# Altium project ESP32 with USB-C.PrjPcb (part 3 of 3)
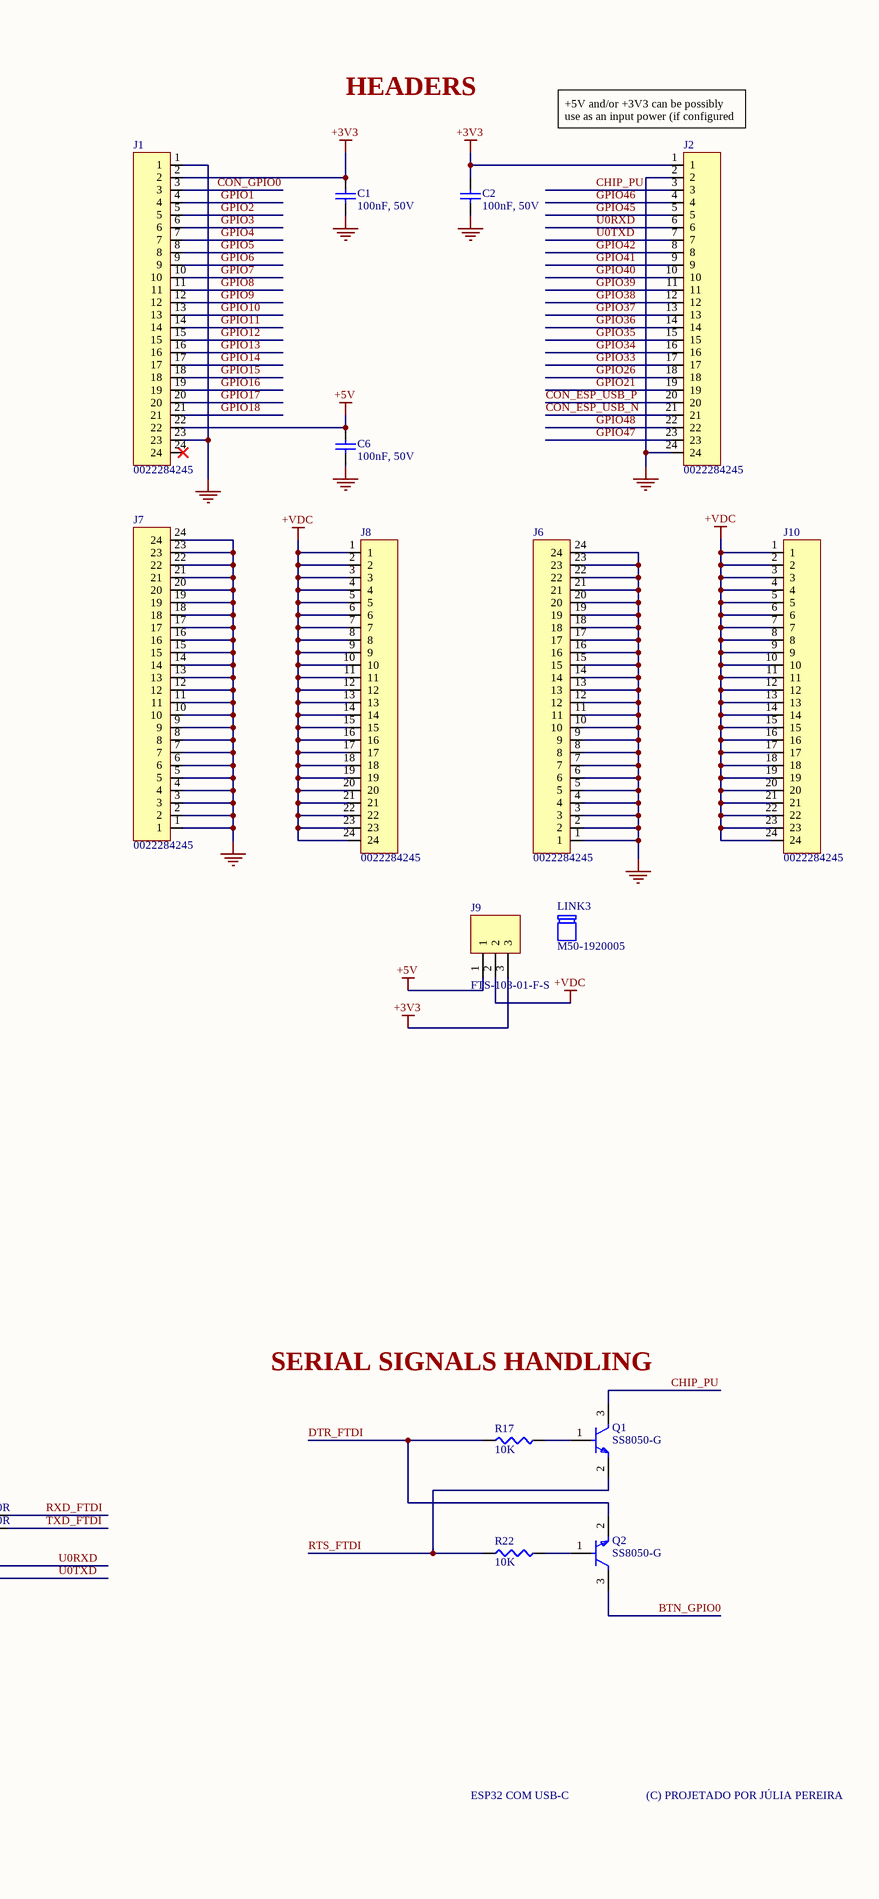
[diagram p3: ESP32 with USBC.SchDoc, right]

## Sheet ESP32 with USBC.SchDoc (continued)

### Library data of the parts (continued)
R13 R16 R17 R22 = AC0402FR-0710KL: 10 kOhms ±1% 0,063W, 1/16W Resistor de chip 0402 (métrico 1005) AEC-Q200 automotivo, resistente a umidade Filme grosso; Manufacturer: Yageo Group; Max Power Dissipation: 63mW; Power Rating: 62.5mW; Value: 10kΩ; Temperature Coefficient: 100ppm/°C; Voltage Rating: 50V; Supplier: DigiKey; Supplier Part Number: YAG3436DKR-ND; Manufacturer Part Number: AC0402FR-0710KL; RoHS: Compliant; Category: Chip SMD Resistors; Stock: 2542190; Pricing: 1=0.1, 10=0.024, 25=0.0176, 50=0.014, 100=0.0114, 250=0.00876, 500=0.00726, 1000=0.00612, 5000=0.00431 (USD); Case/Package: 0402; Case Code (Imperial): 0402; Case Code (Metric): 1005; China RoHS: Non-Compliant; Composition: Thick Film; Country of Origin: Mainland China, Taiwan; Depth: 500µm; Export Control Classification Number (ECCN) Code: EAR99; Features: Automotive AEC-Q200, Moisture Resistant; Height: 320µm; Harmonized Tariff Schedule (HTS) Code: 8533.21.00.30; Introduction Date: 2012-04-10; Lead Free: Lead Free; Length: 1mm; Lifecycle Status: Production; Max Operating Temperature: 155°C; Military Standard: Not; Min Operating Temperature: -55°C; Mounting Technology: Surface Mount; Number of Terminals: 2; Number of Terminations: 2; Packaging: Tape & Reel; Ratings: AEC-Q200; REACH SVHC: Yes; Schedule B: 8533210045, 8533210045|8533210045|8533210045|8533210045|8533210045|8533210045|8533210045|8533210045|8533210045|8533210045|8533210045|8533210045|8533210045|8533210045|8533210045|8533210045|8533210045|8533210045|8533210045, 8533210045|8533210045|8533210045|8533210045|8533210045|8533210045|8533210045|8533210045|8533210045|8533210045|8533210045|8533210045|8533210045|8533210045|8533210045|8533210045|8533210045|8533210045|8533210045|8533210045|8533210045|8533210045|8533210045|85; Termination: SMD/SMT; Tolerance: 1%; Width: 500µm; Working Voltage: 50V; ComponentLink1URL: https://datasheet.octopart.com:443/AC0402FR-0710KL-Yageo-datasheet-182189377.pdf?src-supplier=IHS; ComponentLink1Description: https://datasheet.octopart.com:443/AC0402FR-0710KL-Yageo-datasheet-182189377.pdf?src-supplier=IHS; ComponentLink2URL: https://datasheet.octopart.com:443/AC0402FR-0710KL-Yageo-datasheet-83209224.pdf?src-supplier=Upverter; ComponentLink2Description: https://datasheet.octopart.com:443/AC0402FR-0710KL-Yageo-datasheet-83209224.pdf?src-supplier=Upverter; ComponentLink3URL: https://datasheet.octopart.com:443/AC0402FR-0710KL-Yageo-datasheet-178509465.pdf?src-supplier=Newark; ComponentLink3Description: https://datasheet.octopart.com:443/AC0402FR-0710KL-Yageo-datasheet-178509465.pdf?src-supplier=Newark; ComponentLink4URL: https://datasheet.octopart.com:443/AC0402FR-0710KL-Yageo-datasheet-166720450.pdf?src-supplier=JRH+Electronics; ComponentLink4Description: https://datasheet.octopart.com:443/AC0402FR-0710KL-Yageo-datasheet-166720450.pdf?src-supplier=JRH+Electronics; ComponentLink5URL: https://datasheet.octopart.com:443/AC0402FR-0710KL-Yageo-datasheet-151884373.pdf?src-supplier=Future+Electronics; ComponentLink5Description: https://datasheet.octopart.com:443/AC0402FR-0710KL-Yageo-datasheet-151884373.pdf?src-supplier=Future+Electronics; ComponentLink6URL: https://datasheet.octopart.com:443/AC0402FR-0710KL-Yageo-Group-datasheet-189830439.pdf?src-supplier=Future+Electronics; ComponentLink6Description: https://datasheet.octopart.com:443/AC0402FR-0710KL-Yageo-Group-datasheet-189830439.pdf?src-supplier=Future+Electronics; ComponentLink7URL: https://datasheet.octopart.com:443/AC0402FR-0710KL-Yageo-datasheet-137699919.pdf?src-supplier=Future+Electronics; ComponentLink7Description: https://datasheet.octopart.com:443/AC0402FR-0710KL-Yageo-datasheet-137699919.pdf?src-supplier=Future+Electronics; ComponentLink8URL: https://datasheet.octopart.com:443/AC0402FR-0710KL-Yageo-datasheet-24580492.pdf?src-supplier=Future+Electronics; ComponentLink8Description: https://datasheet.octopart.com:443/AC0402FR-0710KL-Yageo-datasheet-24580492.pdf?src-supplier=Future+Electronics; ComponentLink9URL: https://datasheet.octopart.com:443/AC0402FR-0710KL-Yageo-datasheet-13029202.pdf?src-supplier=Future+Electronics; ComponentLink9Description: https://datasheet.octopart.com:443/AC0402FR-0710KL-Yageo-datasheet-13029202.pdf?src-supplier=Future+Electronics; ComponentLink10URL: https://datasheet.octopart.com/AC0402FR-0710KL-Yageo-datasheet-12512238.pdf; ComponentLink10Description: https://datasheet.octopart.com/AC0402FR-0710KL-Yageo-datasheet-12512238.pdf; ComponentLink11URL: https://datasheet.octopart.com:443/AC0402FR-0710KL-Yageo-Group-datasheet-164768995.pdf?src-supplier=ODG+(Origin+Data+Global); ComponentLink11Description: https://datasheet.octopart.com:443/AC0402FR-0710KL-Yageo-Group-datasheet-164768995.pdf?src-supplier=ODG+(Origin+Data+Global); ComponentLink12URL: https://datasheet.octopart.com:443/AC0402FR-0710KL-Yageo-datasheet-128677448.pdf?src-supplier=X-ON; ComponentLink12Description: https://datasheet.octopart.com:443/AC0402FR-0710KL-Yageo-datasheet-128677448.pdf?src-supplier=X-ON; ComponentLink13URL: http://sigma.octopart.com:80/conflict_mineral_statement/Yageo-company-3.pdf?src-supplier=Compliance+Statements; ComponentLink13Description: http://sigma.octopart.com:80/conflict_mineral_statement/Yageo-company-3.pdf?src-supplier=Compliance+Statements; ComponentLink14URL: http://sigma.octopart.com:80/rohs_statement/Yageo-company-2.pdf?src-supplier=Compliance+Statements; ComponentLink14Description: http://sigma.octopart.com:80/rohs_statement/Yageo-company-2.pdf?src-supplier=Compliance+Statements
R18 R20 = RC0402FR-0727RL: 27 Ohms ±1% 0,063W, 1/16W Resistor de chip 0402 (métrico 1005) Resistente à umidade Filme grosso; Manufacturer: Yageo Group; Max Power Dissipation: 63mW; Power Rating: 62.5mW; Value: 27Ω; Temperature Coefficient: 100ppm/°C; Voltage Rating: 50V; Supplier: DigiKey; Supplier Part Number: YAG3086CT-ND; Manufacturer Part Number: RC0402FR-0727RL; RoHS: Compliant; Category: Chip SMD Resistors; Stock: 186375; Pricing: 1=0.1, 10=0.021, 25=0.0152, 50=0.012, 100=0.0097, 250=0.0074, 500=0.00612, 1000=0.00512, 5000=0.00355 (USD); Case/Package: 0402; Case Code (Imperial): 0402; Case Code (Metric): 1005; China RoHS: Non-Compliant; Composition: Thick Film; Country of Origin: Mainland China, Taiwan; Depth: 500µm; Export Control Classification Number (ECCN) Code: EAR99; Features: Moisture Resistant; Height: 350µm; Harmonized Tariff Schedule (HTS) Code: 8533.21.00.30; Introduction Date: 2008-07-18; Lead Free: Lead Free; Length: 1mm; Lifecycle Status: Production; Max Operating Temperature: 155°C; Military Standard: Not; Min Operating Temperature: -55°C; Mounting Technology: Surface Mount; Pins: 2; Number of Terminals: 2; Number of Terminations: 2; REACH SVHC: Yes; Schedule B: 8533210045, 8533210045|8533210045, 8533210045|8533210045|8533210045, 8533210045|8533210045|8533210045|8533210045; Termination: SMD/SMT; Tolerance: 1%; Voltage Rating (AC): 50V; Voltage Rating (DC): 50V; Weight: 652.039032µg; Width: 500µm; Working Voltage: 50V; ComponentLink1URL: https://datasheet.octopart.com:443/RC0402FR-0727RL-Yageo-datasheet-175887523.pdf?src-supplier=Newark; ComponentLink1Description: https://datasheet.octopart.com:443/RC0402FR-0727RL-Yageo-datasheet-175887523.pdf?src-supplier=Newark; ComponentLink2URL: https://datasheet.octopart.com:443/RC0402FR-0727RL-Yageo-datasheet-8324527.pdf?src-supplier=Newark; ComponentLink2Description: https://datasheet.octopart.com:443/RC0402FR-0727RL-Yageo-datasheet-8324527.pdf?src-supplier=Newark; ComponentLink3URL: https://datasheet.octopart.com:443/RC0402FR-0727RL-Yageo-datasheet-103092701.pdf?src-supplier=Upverter; ComponentLink3Description: https://datasheet.octopart.com:443/RC0402FR-0727RL-Yageo-datasheet-103092701.pdf?src-supplier=Upverter; ComponentLink4URL: https://datasheet.octopart.com:443/RC0402FR-0727RL-Yageo-datasheet-10408619.pdf?src-supplier=element14+APAC; ComponentLink4Description: https://datasheet.octopart.com:443/RC0402FR-0727RL-Yageo-datasheet-10408619.pdf?src-supplier=element14+APAC; ComponentLink5URL: https://datasheet.octopart.com:443/RC0402FR-0727RL-Yageo-datasheet-62067350.pdf?src-supplier=element14+APAC; ComponentLink5Description: https://datasheet.octopart.com:443/RC0402FR-0727RL-Yageo-datasheet-62067350.pdf?src-supplier=element14+APAC; ComponentLink6URL: https://datasheet.octopart.com:443/RC0402FR-0727RL-Yageo-Group-datasheet-189192902.pdf?src-supplier=LCSC; ComponentLink6Description: https://datasheet.octopart.com:443/RC0402FR-0727RL-Yageo-Group-datasheet-189192902.pdf?src-supplier=LCSC; ComponentLink7URL: https://datasheet.octopart.com:443/RC0402FR-0727RL-Yageo-Group-datasheet-176638170.pdf?src-supplier=Future+Electronics; ComponentLink7Description: https://datasheet.octopart.com:443/RC0402FR-0727RL-Yageo-Group-datasheet-176638170.pdf?src-supplier=Future+Electronics; ComponentLink8URL: https://datasheet.octopart.com:443/RC0402FR-0727RL-Yageo-datasheet-164759695.pdf?src-supplier=Future+Electronics; ComponentLink8Description: https://datasheet.octopart.com:443/RC0402FR-0727RL-Yageo-datasheet-164759695.pdf?src-supplier=Future+Electronics; ComponentLink9URL: https://datasheet.octopart.com:443/RC0402FR-0727RL-Yageo-datasheet-137700087.pdf?src-supplier=Future+Electronics; ComponentLink9Description: https://datasheet.octopart.com:443/RC0402FR-0727RL-Yageo-datasheet-137700087.pdf?src-supplier=Future+Electronics; ComponentLink10URL: https://datasheet.octopart.com:443/RC0402FR-0727RL-Yageo-datasheet-12531192.pdf?src-supplier=Future+Electronics; ComponentLink10Description: https://datasheet.octopart.com:443/RC0402FR-0727RL-Yageo-datasheet-12531192.pdf?src-supplier=Future+Electronics; ComponentLink11URL: https://datasheet.octopart.com:443/RC0402FR-0727RL-Yageo-datasheet-175423674.pdf?src-supplier=SOS+electronic; ComponentLink11Description: https://datasheet.octopart.com:443/RC0402FR-0727RL-Yageo-datasheet-175423674.pdf?src-supplier=SOS+electronic; ComponentLink12URL: https://datasheet.octopart.com:443/RC0402FR-0727RL-Yageo-datasheet-8329306.pdf?src-supplier=SOS+electronic; ComponentLink12Description: https://datasheet.octopart.com:443/RC0402FR-0727RL-Yageo-datasheet-8329306.pdf?src-supplier=SOS+electronic; ComponentLink13URL: https://datasheet.octopart.com:443/RC0402FR-0727RL-Yageo-datasheet-148775077.pdf?src-supplier=TME; ComponentLink13Description: https://datasheet.octopart.com:443/RC0402FR-0727RL-Yageo-datasheet-148775077.pdf?src-supplier=TME; ComponentLink14URL: https://datasheet.octopart.com/RC0402FR-0727RL-Yageo-datasheet-73766026.pdf; ComponentLink14Description: https://datasheet.octopart.com/RC0402FR-0727RL-Yageo-datasheet-73766026.pdf; ComponentLink15URL: http://sigma.octopart.com:80/conflict_mineral_statement/Yageo-company-3.pdf?src-supplier=Compliance+Statements; ComponentLink15Description: http://sigma.octopart.com:80/conflict_mineral_statement/Yageo-company-3.pdf?src-supplier=Compliance+Statements; ComponentLink16URL: http://sigma.octopart.com:80/rohs_statement/Yageo-company-2.pdf?src-supplier=Compliance+Statements; ComponentLink16Description: http://sigma.octopart.com:80/rohs_statement/Yageo-company-2.pdf?src-supplier=Compliance+Statements
R19 R21 R23-R26 = RC0402JR-070RL: 0 Ohms Jumper Resistor de chip 0402 (métrico 1005) Resistente à umidade Filme grosso; Manufacturer: Yageo Group; Max Power Dissipation: 63mW; Power Rating: 62.5mW; Value: 0Ω; Temperature Coefficient: 200ppm/°C; Tolerance: 5%; Voltage Rating: 50V; Supplier: DigiKey; Supplier Part Number: 311-0.0JRDKR-ND; Manufacturer Part Number: RC0402JR-070RL; RoHS: Compliant; Category: Chip SMD Resistors; Stock: 7130979; Pricing: 1=0.1, 10=0.010, 25=0.0064, 50=0.0056, 100=0.0048, 250=0.00404, 500=0.00356, 1000=0.00313, 5000=0.00237 (USD); Case/Package: 0402; Case Code (Imperial): 0402; China RoHS: Non-Compliant; Composition: Thick Film; Contact Plating: Tin; Depth: 500µm; Features: Moisture Resistant; Height: 350µm; Lead Free: Lead Free; Length: 1mm; Lifecycle Status: Production; Max Operating Temperature: 155°C; Military Standard: Not; Min Operating Temperature: -55°C; Mounting Technology: Surface Mount; Pins: 2; Number of Terminals: 2; Number of Terminations: 2; Packaging: Tape & Reel; Radiation Hardening: No; REACH SVHC: Yes; Schedule B: 8533290000, 8533290000|8533290000, 8533290000|8533290000|8533290000, 8533290000|8533290000|8533290000|8533290000; Termination: SMD/SMT; Voltage Rating (DC): 50V; Width: 500µm; ComponentLink1URL: https://datasheet.octopart.com:443/RC0402JR-070RL-Yageo-datasheet-182189538.pdf?src-supplier=IHS; ComponentLink1Description: https://datasheet.octopart.com:443/RC0402JR-070RL-Yageo-datasheet-182189538.pdf?src-supplier=IHS; ComponentLink2URL: https://datasheet.octopart.com:443/RC0402JR-070RL-Yageo-datasheet-10408619.pdf?src-supplier=Newark; ComponentLink2Description: https://datasheet.octopart.com:443/RC0402JR-070RL-Yageo-datasheet-10408619.pdf?src-supplier=Newark; ComponentLink3URL: https://datasheet.octopart.com:443/RC0402JR-070RL-Yageo-Group-datasheet-181964826.pdf?src-supplier=Newark; ComponentLink3Description: https://datasheet.octopart.com:443/RC0402JR-070RL-Yageo-Group-datasheet-181964826.pdf?src-supplier=Newark; ComponentLink4URL: https://datasheet.octopart.com:443/RC0402JR-070RL-Yageo-Group-datasheet-190305687.pdf?src-supplier=Future+Electronics; ComponentLink4Description: https://datasheet.octopart.com:443/RC0402JR-070RL-Yageo-Group-datasheet-190305687.pdf?src-supplier=Future+Electronics; ComponentLink5URL: https://datasheet.octopart.com:443/RC0402JR-070RL-Yageo-datasheet-164759695.pdf?src-supplier=Future+Electronics; ComponentLink5Description: https://datasheet.octopart.com:443/RC0402JR-070RL-Yageo-datasheet-164759695.pdf?src-supplier=Future+Electronics; ComponentLink6URL: https://datasheet.octopart.com:443/RC0402JR-070RL-Yageo-datasheet-137700087.pdf?src-supplier=Future+Electronics; ComponentLink6Description: https://datasheet.octopart.com:443/RC0402JR-070RL-Yageo-datasheet-137700087.pdf?src-supplier=Future+Electronics; ComponentLink7URL: https://datasheet.octopart.com:443/RC0402JR-070RL-Yageo-datasheet-12531192.pdf?src-supplier=Seeed+Studio; ComponentLink7Description: https://datasheet.octopart.com:443/RC0402JR-070RL-Yageo-datasheet-12531192.pdf?src-supplier=Seeed+Studio; ComponentLink8URL: https://datasheet.octopart.com:443/RC0402JR-070RL-Yageo-datasheet-8324527.pdf?src-supplier=TME; ComponentLink8Description: https://datasheet.octopart.com:443/RC0402JR-070RL-Yageo-datasheet-8324527.pdf?src-supplier=TME; ComponentLink9URL: https://datasheet.octopart.com:443/RC0402JR-070RL-Yageo-datasheet-62067350.pdf?src-supplier=Farnell; ComponentLink9Description: https://datasheet.octopart.com:443/RC0402JR-070RL-Yageo-datasheet-62067350.pdf?src-supplier=Farnell; ComponentLink10URL: https://datasheet.octopart.com:443/RC0402JR-070RL-Yageo-datasheet-8329306.pdf?src-supplier=element14; ComponentLink10Description: https://datasheet.octopart.com:443/RC0402JR-070RL-Yageo-datasheet-8329306.pdf?src-supplier=element14; ComponentLink11URL: https://datasheet.octopart.com:443/RC0402JR-070RL-Yageo-datasheet-505231.pdf?src-supplier=element14; ComponentLink11Description: https://datasheet.octopart.com:443/RC0402JR-070RL-Yageo-datasheet-505231.pdf?src-supplier=element14; ComponentLink12URL: https://datasheet.octopart.com:443/RC0402JR-070RL-Yageo-datasheet-175423674.pdf?src-supplier=SOS+electronic; ComponentLink12Description: https://datasheet.octopart.com:443/RC0402JR-070RL-Yageo-datasheet-175423674.pdf?src-supplier=SOS+electronic; ComponentLink13URL: https://datasheet.octopart.com/RC0402JR-070RL-Yageo-datasheet-73766026.pdf; ComponentLink13Description: https://datasheet.octopart.com/RC0402JR-070RL-Yageo-datasheet-73766026.pdf; ComponentLink14URL: http://sigma.octopart.com:80/conflict_mineral_statement/Yageo-company-3.pdf?src-supplier=Compliance+Statements; ComponentLink14Description: http://sigma.octopart.com:80/conflict_mineral_statement/Yageo-company-3.pdf?src-supplier=Compliance+Statements; ComponentLink15URL: http://sigma.octopart.com:80/rohs_statement/Yageo-company-2.pdf?src-supplier=Compliance+Statements; ComponentLink15Description: http://sigma.octopart.com:80/rohs_statement/Yageo-company-2.pdf?src-supplier=Compliance+Statements
R27 R28 = CR0805AJ/-000EAS: RESA-AS 0805 0R JUMPER 125MW; Manufacturer: Bourns; Value: 0Ω; Temperature Coefficient: 400ppm/°C; Tolerance: 5%; Voltage Rating: 150V; Supplier: DigiKey; Supplier Part Number: CR0805AJ/-000EASCT-ND; Manufacturer Part Number: CR0805AJ/-000EAS; RoHS: Compliant; Category: Chip SMD Resistors; Stock: 47987; Pricing: 1=0.1, 10=0.039, 25=0.0296, 50=0.024, 100=0.0199, 250=0.01576, 500=0.01342, 1000=0.01156 (USD); Case/Package: 0805; China RoHS: Non-Compliant; Composition: Thick Film; Country of Origin: Taiwan; Export Control Classification Number (ECCN) Code: EAR99; Height: 500µm; Harmonized Tariff Schedule (HTS) Code: 8533.21.00.30; Introduction Date: 2019-05-31; Length: 2mm; Lifecycle Status: Production; Max Operating Temperature: 155°C; Min Operating Temperature: -55°C; Mounting Technology: Surface Mount; Number of Terminals: 2; Power Rating: 125mW; Ratings: AEC-Q200; REACH SVHC: Yes; Voltage Rating (DC): 150V; Width: 1.25mm; ComponentLink1URL: https://datasheet.octopart.com:443/CR0805AJ--000EAS-Bourns-datasheet-181955238.pdf?src-supplier=IHS; ComponentLink1Description: https://datasheet.octopart.com:443/CR0805AJ--000EAS-Bourns-datasheet-181955238.pdf?src-supplier=IHS; ComponentLink2URL: https://datasheet.octopart.com:443/CR0805AJ--000EAS-Bourns-datasheet-181955240.pdf?src-supplier=IHS; ComponentLink2Description: https://datasheet.octopart.com:443/CR0805AJ--000EAS-Bourns-datasheet-181955240.pdf?src-supplier=IHS; ComponentLink3URL: https://datasheet.octopart.com:443/CR0805AJ--000EAS-Bourns-datasheet-166097895.pdf?src-supplier=Electro+Sonic; ComponentLink3Description: https://datasheet.octopart.com:443/CR0805AJ--000EAS-Bourns-datasheet-166097895.pdf?src-supplier=Electro+Sonic; ComponentLink4URL: https://datasheet.octopart.com:443/CR0805AJ--000EAS-Bourns-datasheet-136430691.pdf?src-supplier=Electro+Sonic; ComponentLink4Description: https://datasheet.octopart.com:443/CR0805AJ--000EAS-Bourns-datasheet-136430691.pdf?src-supplier=Electro+Sonic; ComponentLink5URL: https://datasheet.octopart.com:443/CR0805AJ--000EAS-Bourns-datasheet-177039331.pdf?src-supplier=Burklin+Elektronik; ComponentLink5Description: https://datasheet.octopart.com:443/CR0805AJ--000EAS-Bourns-datasheet-177039331.pdf?src-supplier=Burklin+Elektronik; ComponentLink6URL: http://sigma.octopart.com:80/conflict_mineral_statement/Bourns-company-36.pdf?src-supplier=Compliance+Statements; ComponentLink6Description: http://sigma.octopart.com:80/conflict_mineral_statement/Bourns-company-36.pdf?src-supplier=Compliance+Statements
SW1 SW2 = TS04-66-50-BK-160-SMT-TR: 6 x 6 mm, 5 mm Actuator Height Off PCB, 160 gf, Black, Surface Mount, SPST, Tactile Switch; Manufacturer: Same Sky; Number of Positions: 2; Supplier: DigiKey; Supplier Part Number: 2223-TS04-66-50-BK-160-SMT-TR-ND; Manufacturer Part Number: TS04-66-50-BK-160-SMT-TR; RoHS: Compliant; Category: Tactile Switches; Pricing: 5000=0.11349 (USD); Export Control Classification Number (ECCN) Code: EAR99; Harmonized Tariff Schedule (HTS) Code: 8536.50.70.00; Introduction Date: 2023-06-27; Lifecycle Status: Production; REACH SVHC: Yes; ComponentLink1URL: https://datasheet.octopart.com:443/TS04-66-50-BK-160-SMT-TR-Same-Sky-datasheet-183540778.pdf?src-supplier=Same+Sky; ComponentLink1Description: https://datasheet.octopart.com:443/TS04-66-50-BK-160-SMT-TR-Same-Sky-datasheet-183540778.pdf?src-supplier=Same+Sky; ComponentLink2URL: https://datasheet.octopart.com:443/TS04-66-50-BK-160-SMT-TR-Same-Sky-datasheet-181920469.pdf?src-supplier=Same+Sky; ComponentLink2Description: https://datasheet.octopart.com:443/TS04-66-50-BK-160-SMT-TR-Same-Sky-datasheet-181920469.pdf?src-supplier=Same+Sky; ComponentLink3URL: https://datasheet.octopart.com:443/TS04-66-50-BK-160-SMT-TR-CUI-Devices-datasheet-175928975.pdf?src-supplier=Same+Sky; ComponentLink3Description: https://datasheet.octopart.com:443/TS04-66-50-BK-160-SMT-TR-CUI-Devices-datasheet-175928975.pdf?src-supplier=Same+Sky; ComponentLink4URL: https://datasheet.octopart.com:443/TS04-66-50-BK-160-SMT-TR-CUI-Devices-datasheet-155929909.pdf?src-supplier=Same+Sky; ComponentLink4Description: https://datasheet.octopart.com:443/TS04-66-50-BK-160-SMT-TR-CUI-Devices-datasheet-155929909.pdf?src-supplier=Same+Sky; ComponentLink5URL: https://datasheet.octopart.com:443/TS04-66-50-BK-160-SMT-TR-CUI-Devices-datasheet-180438940.pdf?src-supplier=IHS; ComponentLink5Description: https://datasheet.octopart.com:443/TS04-66-50-BK-160-SMT-TR-CUI-Devices-datasheet-180438940.pdf?src-supplier=IHS; ComponentLink6URL: https://datasheet.octopart.com:443/TS04-66-50-BK-160-SMT-TR-Same-Sky-datasheet-192884241.pdf?src-supplier=Farnell; ComponentLink6Description: https://datasheet.octopart.com:443/TS04-66-50-BK-160-SMT-TR-Same-Sky-datasheet-192884241.pdf?src-supplier=Farnell; ComponentLink7URL: https://datasheet.octopart.com:443/TS04-66-50-BK-160-SMT-TR-Same-Sky-datasheet-182881590.pdf?src-supplier=Master+Electronics; ComponentLink7Description: https://datasheet.octopart.com:443/TS04-66-50-BK-160-SMT-TR-Same-Sky-datasheet-182881590.pdf?src-supplier=Master+Electronics; ComponentLink8URL: https://datasheet.octopart.com:443/TS04-66-50-BK-160-SMT-TR-Same-Sky-datasheet-189105765.pdf?src-supplier=Master+Electronics; ComponentLink8Description: https://datasheet.octopart.com:443/TS04-66-50-BK-160-SMT-TR-Same-Sky-datasheet-189105765.pdf?src-supplier=Master+Electronics; ComponentLink9URL: https://datasheet.octopart.com:443/TS04-66-50-BK-160-SMT-TR-Same-Sky-datasheet-188930959.pdf?src-supplier=TME; ComponentLink9Description: https://datasheet.octopart.com:443/TS04-66-50-BK-160-SMT-TR-Same-Sky-datasheet-188930959.pdf?src-supplier=TME; ComponentLink10URL: https://octopart.com:443/opatz8j6/c1?t=wXATGi29fPEBEaziTelqDuU4PjQuUS8e8k50uqTGR8-f8PgSBgVO23hGk56Y_9yeRFefFNyFnsWboRRpBFO4Z5GgYLXGLoSxKwNwRa_8Tp-KukLkkmWWLplkTid4u4PgvbN9QXkqZx3SvyHDehfYxERuFRNpFvwLRToYdcioo1Dg-fIU-JxuJPsKb2-K_Po4qppweD5kOyk7OvfzQ6TECoWM0aQoKTilEezgdpbRxwdJdsQr6i-FhRWHfUjlqSsVHg459MHKJuvnfhywZNmHdO84fN_K0pIzXyk-L2zKyvuCT_vzM6c4F_4O5jG0QDPBr-XwNBoTKaJRAcwbZ4CzY9PqBRYaKyEwG8v_COsLzutLKKxY4UQ&src-supplier=Compliance+Statements; ComponentLink10Description: https://octopart.com:443/opatz8j6/c1?t=wXATGi29fPEBEaziTelqDuU4PjQuUS8e8k50uqTGR8-f8PgSBgVO23hGk56Y_9yeRFefFNyFnsWboRRpBFO4Z5GgYLXGLoSxKwNwRa_8Tp-KukLkkmWWLplkTid4u4PgvbN9QXkqZx3SvyHDehfYxERuFRNpFvwLRToYdcioo1Dg-fIU-JxuJPsKb2-K_Po4qppweD5kOyk7OvfzQ6TECoWM0aQoKTilEezgdpbRxwdJdsQr6i-FhRWHfUjlqSsVHg459MHKJuvnfhywZNmHdO84fN_K0pIzXyk-L2zKyvuCT_vzM6c4F_4O5jG0QDPBr-XwNBoTKaJRAcwbZ4CzY9PqBRYaKyEwG8v_COsLzutLKKxY4UQ&src-supplier=Compliance+Statements; ComponentLink11URL: https://octopart.com:443/opatz8j6/c1?t=p2TLJHnNQU5qlsQan8Qpysm1gcHHFkxZ-ir3gws2NIFZsLqSVtVrPAp336WxfVnk66n8wM5ZdsQtScaOMtCZ0-HZvBrFwXHrcbv5Yq5ZC4M4fiY17k1NIHCjlgh28Ac4ncpeiVMqI0LlhO4WwaQqkI3On40VtJzlfvpT4EHZ0vjQWg8L5W01S18c9FU597cVPUSexHR5_RYX72dTAxv6eIsa1ucz0O_omxMQChzLKM3MfI47D4CsQmH93DeZoUoENbS-vDXsp7cmIkWpy2s-NKL21KtClmdxhcpmFaYQdtw3Z2lb7N4evOux36vQ-Hq3rwotWB-tPeVAGeGPz7hT5QqDNb-k613nGWKGo2ZC5B3KxNfn3KKjdOHO&src-supplier=Compliance+Statements; ComponentLink11Description: https://octopart.com:443/opatz8j6/c1?t=p2TLJHnNQU5qlsQan8Qpysm1gcHHFkxZ-ir3gws2NIFZsLqSVtVrPAp336WxfVnk66n8wM5ZdsQtScaOMtCZ0-HZvBrFwXHrcbv5Yq5ZC4M4fiY17k1NIHCjlgh28Ac4ncpeiVMqI0LlhO4WwaQqkI3On40VtJzlfvpT4EHZ0vjQWg8L5W01S18c9FU597cVPUSexHR5_RYX72dTAxv6eIsa1ucz0O_omxMQChzLKM3MfI47D4CsQmH93DeZoUoENbS-vDXsp7cmIkWpy2s-NKL21KtClmdxhcpmFaYQdtw3Z2lb7N4evOux36vQ-Hq3rwotWB-tPeVAGeGPz7hT5QqDNb-k613nGWKGo2ZC5B3KxNfn3KKjdOHO&src-supplier=Compliance+Statements; ComponentLink12URL: https://octopart.com:443/opatz8j6/c1?t=ylxFcKVPDFyVV8TDOeNe2SygdUl2TpVSZVQEynucVw5a7V4jjDZLFfYzFaf7H_lLeCTHkGXJ2DQ-z1VQj5byxs0GYoSLIGId6ICV3C9wF6hSyOJIU0ghU8LwGHMVggKi1sZiGb_MbzI3b07gjVxOCg3Bo0-RzVST-DzPbuHrRJ3vZj3c5JJ3uVum6yD1o5c7hVYNhONRcucMvt-d64AkeyUKu_Xm7TWKf5ylRuodCoH9yHsHLzpxF_GGuQMjgpH0tDWjSb9noWfW0RQYURZfGA5N2YdqPOAnCge0ZMKWql7eCEZx7gpSpDVt1c93h-Js8cbVwBiRv8Idudp0gGjHE_PLdHhIf57-gm8ag3fn972HmQpCOng&src-supplier=Compliance+Statements; ComponentLink12Description: https://octopart.com:443/opatz8j6/c1?t=ylxFcKVPDFyVV8TDOeNe2SygdUl2TpVSZVQEynucVw5a7V4jjDZLFfYzFaf7H_lLeCTHkGXJ2DQ-z1VQj5byxs0GYoSLIGId6ICV3C9wF6hSyOJIU0ghU8LwGHMVggKi1sZiGb_MbzI3b07gjVxOCg3Bo0-RzVST-DzPbuHrRJ3vZj3c5JJ3uVum6yD1o5c7hVYNhONRcucMvt-d64AkeyUKu_Xm7TWKf5ylRuodCoH9yHsHLzpxF_GGuQMjgpH0tDWjSb9noWfW0RQYURZfGA5N2YdqPOAnCge0ZMKWql7eCEZx7gpSpDVt1c93h-Js8cbVwBiRv8Idudp0gGjHE_PLdHhIf57-gm8ag3fn972HmQpCOng&src-supplier=Compliance+Statements; ComponentLink13URL: https://octopart.com:443/opatz8j6/c1?t=M9eWbvfRviNp-qE0okpIKaju1sUmsy1TlbZSrQ4hz6ti2FFsII0CRvIF4K-ij6Ih1P1De_YK24ptP99g8yiUhSLDLjlAiH2DarKOwJ2v1Xxp8Ap5ZX83uv7Mj7XNEk8G2-5N5-FchZSuApQ62O6eyUHvjVEjSxQKGhDO0LPZHX2BcxyvBzyDMwH73uFOgB_V2bL4s3KG_n47l2C9bO1k3Z6ZcFQr4fyVf_uOzwwCkrwcCzwLkH9bvWMYWG65ThUV3LRmvW52i_q9G1Ei4ESL-cP78STGTy9zE8CbxwkkK1brZQL0qn4_4RBfos-ue2_817-VcvY9Ym132jmvLdtzxEpR5mIRKPJTVNLgOY5E14ju5pdFtMXRiabV&src-supplier=Compliance+Statements; ComponentLink13Description: https://octopart.com:443/opatz8j6/c1?t=M9eWbvfRviNp-qE0okpIKaju1sUmsy1TlbZSrQ4hz6ti2FFsII0CRvIF4K-ij6Ih1P1De_YK24ptP99g8yiUhSLDLjlAiH2DarKOwJ2v1Xxp8Ap5ZX83uv7Mj7XNEk8G2-5N5-FchZSuApQ62O6eyUHvjVEjSxQKGhDO0LPZHX2BcxyvBzyDMwH73uFOgB_V2bL4s3KG_n47l2C9bO1k3Z6ZcFQr4fyVf_uOzwwCkrwcCzwLkH9bvWMYWG65ThUV3LRmvW52i_q9G1Ei4ESL-cP78STGTy9zE8CbxwkkK1brZQL0qn4_4RBfos-ue2_817-VcvY9Ym132jmvLdtzxEpR5mIRKPJTVNLgOY5E14ju5pdFtMXRiabV&src-supplier=Compliance+Statements
U1 = CP2102N-A02-GQFN24R: IC Usb to Uart Bridge QFN24 / Usb Bridge, Usb to Uart Usb 2.0 Uart Interface 24-QFN (4X4); Manufacturer: Silicon Lab; Manufacturer Lifecycle Status: FULL PRODUCTION; Data Rate: 1.5Mbps; Max Junction Temperature (Tj): 105°C; Max Supply Voltage: 3.6V; Min Supply Voltage: 3V; Nominal Supply Voltage (DC): 3.3V; Number of Digital IO: 4; Supplier: DigiKey; Supplier Part Number: 336-5888-1-ND; Manufacturer Part Number: CP2102N-A02-GQFN24R; RoHS: Compliant; Category: USB Interface ICs; Stock: 14627; Pricing: 1=5.46, 10=4.14, 25=3.81, 100=3.4474, 250=3.27444, 500=3.1702 (USD); Ambient Temperature Range High: 85°C; China RoHS: Compliant; Height: 800µm; Height - Seated (Max): 800µm; Harmonized Tariff Schedule (HTS) Code: 8542.31.00.30; Interface: UART; Introduction Date: 2019-03-12; Length: 4mm; Lifecycle Status: Production; Max Operating Temperature: 85°C; Min Operating Temperature: -40°C; Number of Terminals: 24; REACH SVHC: Yes; Schedule B: 8542390000, 8542390000|8542390000|8542390000|8542390000|8542390000; Temperature Grade: Industrial; Terminal Pitch: 500µm; Width: 4mm; ComponentLink1URL: https://datasheet.octopart.com:443/CP2102N-A02-GQFN24R-Silicon-Labs-datasheet-138898368.pdf?src-supplier=SHENGYU+ELECTRONICS; ComponentLink1Description: https://datasheet.octopart.com:443/CP2102N-A02-GQFN24R-Silicon-Labs-datasheet-138898368.pdf?src-supplier=SHENGYU+ELECTRONICS; ComponentLink2URL: https://datasheet.octopart.com:443/CP2102N-A02-GQFN24R-Silicon-Labs-datasheet-166051788.pdf?src-supplier=Burklin+Elektronik; ComponentLink2Description: https://datasheet.octopart.com:443/CP2102N-A02-GQFN24R-Silicon-Labs-datasheet-166051788.pdf?src-supplier=Burklin+Elektronik
U2 = AZ1117IH-3.3TRG1: LDO Voltage Regulator, 1 Output, Fixed, 0-15V in, 3.3V Out, 1.2V Drop, 1A out, SOT-223-3; Manufacturer: Diodes Inc.; Accuracy: 1%; Max Supply Voltage: 15V; Max Junction Temperature (Tj): 125°C; Min Input Voltage: 5.3V; Min Supply Voltage: 4.5V; Nominal Supply Current: 4mA; Number of Channels: 1; Voltage Tolerance: 2%; Supplier: DigiKey; Supplier Part Number: AZ1117IH-3.3TRG1DICT-ND; Manufacturer Part Number: AZ1117IH-3.3TRG1; RoHS: Compliant; Category: LDO Voltage Regulators; Stock: 27; Pricing: 1=0.3, 10=0.205, 25=0.1812, 50=0.1668, 100=0.1552 (USD); Case/Package: SOP; China RoHS: Compliant; Country of Origin: Mainland China; Dropout Voltage: 1.2V; Export Control Classification Number (ECCN) Code: EAR99; Height: 1.8mm; Height - Seated (Max): 1.8mm; Harmonized Tariff Schedule (HTS) Code: 8542.39.00.60; Introduction Date: 2015-12-04; Length: 6.5mm; Lifecycle Status: Production; Max Operating Temperature: 125°C; Min Current Limit: 1A; Min Operating Temperature: -40°C; Mounting Technology: Surface Mount; Number of Circuits: 1; Number of Outputs: 1; Pins: 3; Number of Regulators: 1; Number of Terminals: 4; Output Current: 1A; Output Voltage: 3.3V; REACH SVHC: Yes; Schedule B: 8542390000; Terminal Pitch: 2.3mm; Width: 3.5mm; ComponentLink1URL: https://datasheet.octopart.com:443/AZ1117IH-3.3TRG1-Diodes-Inc.-datasheet-180550926.pdf?src-supplier=IHS; ComponentLink1Description: https://datasheet.octopart.com:443/AZ1117IH-3.3TRG1-Diodes-Inc.-datasheet-180550926.pdf?src-supplier=IHS; ComponentLink2URL: https://datasheet.octopart.com:443/AZ1117IH-3.3TRG1-Diodes-Inc.-datasheet-141402639.pdf?src-supplier=SHENGYU+ELECTRONICS; ComponentLink2Description: https://datasheet.octopart.com:443/AZ1117IH-3.3TRG1-Diodes-Inc.-datasheet-141402639.pdf?src-supplier=SHENGYU+ELECTRONICS; ComponentLink3URL: https://sigma.octopart.com:443/138895852/technical_drawing/Diodes-Inc.-AZ1117IH-3.3TRG1.pdf?src-supplier=Upverter; ComponentLink3Description: https://sigma.octopart.com:443/138895852/technical_drawing/Diodes-Inc.-AZ1117IH-3.3TRG1.pdf?src-supplier=Upverter
U3 = ESP32-S3-MINI-1-N8: 20.5dBm ESP32-S3FN8 Chip 2.4GHz SMD WiFi Modules ROHS; Manufacturer: Espressif Systems; Supplier: DigiKey; Supplier Part Number: 5407-ESP32-S3-MINI-1-N8DKR-ND; Manufacturer Part Number: ESP32-S3-MINI-1-N8; RoHS: Compliant; Category: RF Transceiver Modules and Modems; Stock: 7029; Pricing: 1=5,43, 10=4,703, 25=4,4492, 100=4,0995, 250=3,89008 (USD); ComponentLink1URL: https://datasheet.octopart.com:443/ESP32-S3-MINI-1-N8-Espressif-Systems-datasheet-194171672.pdf?src-supplier=LCSC; ComponentLink1Description: https://datasheet.octopart.com:443/ESP32-S3-MINI-1-N8-Espressif-Systems-datasheet-194171672.pdf?src-supplier=LCSC; ComponentLink2URL: https://datasheet.octopart.com:443/ESP32-S3-MINI-1-N8-Espressif-Systems-datasheet-188867343.pdf?src-supplier=TME; ComponentLink2Description: https://datasheet.octopart.com:443/ESP32-S3-MINI-1-N8-Espressif-Systems-datasheet-188867343.pdf?src-supplier=TME; ComponentLink3URL: https://datasheet.octopart.com:443/ESP32-S3-MINI-1-N8-Espressif-Systems-datasheet-165560562.pdf?src-supplier=TME; ComponentLink3Description: https://datasheet.octopart.com:443/ESP32-S3-MINI-1-N8-Espressif-Systems-datasheet-165560562.pdf?src-supplier=TME; ComponentLink4URL: https://datasheet.octopart.com:443/ESP32-S3-MINI-1-N8-Espressif-Systems-datasheet-165560559.pdf?src-supplier=TME; ComponentLink4Description: https://datasheet.octopart.com:443/ESP32-S3-MINI-1-N8-Espressif-Systems-datasheet-165560559.pdf?src-supplier=TME; ComponentLink5URL: https://datasheet.octopart.com:443/ESP32-S3-MINI-1-N8-Espressif-Systems-datasheet-192318068.pdf?src-supplier=HQonline; ComponentLink5Description: https://datasheet.octopart.com:443/ESP32-S3-MINI-1-N8-Espressif-Systems-datasheet-192318068.pdf?src-supplier=HQonline

## Assembly variants
Prototype: not fitted C17 R25 R26